# EAGLE schematic prog (EAGLE 7.6.0)
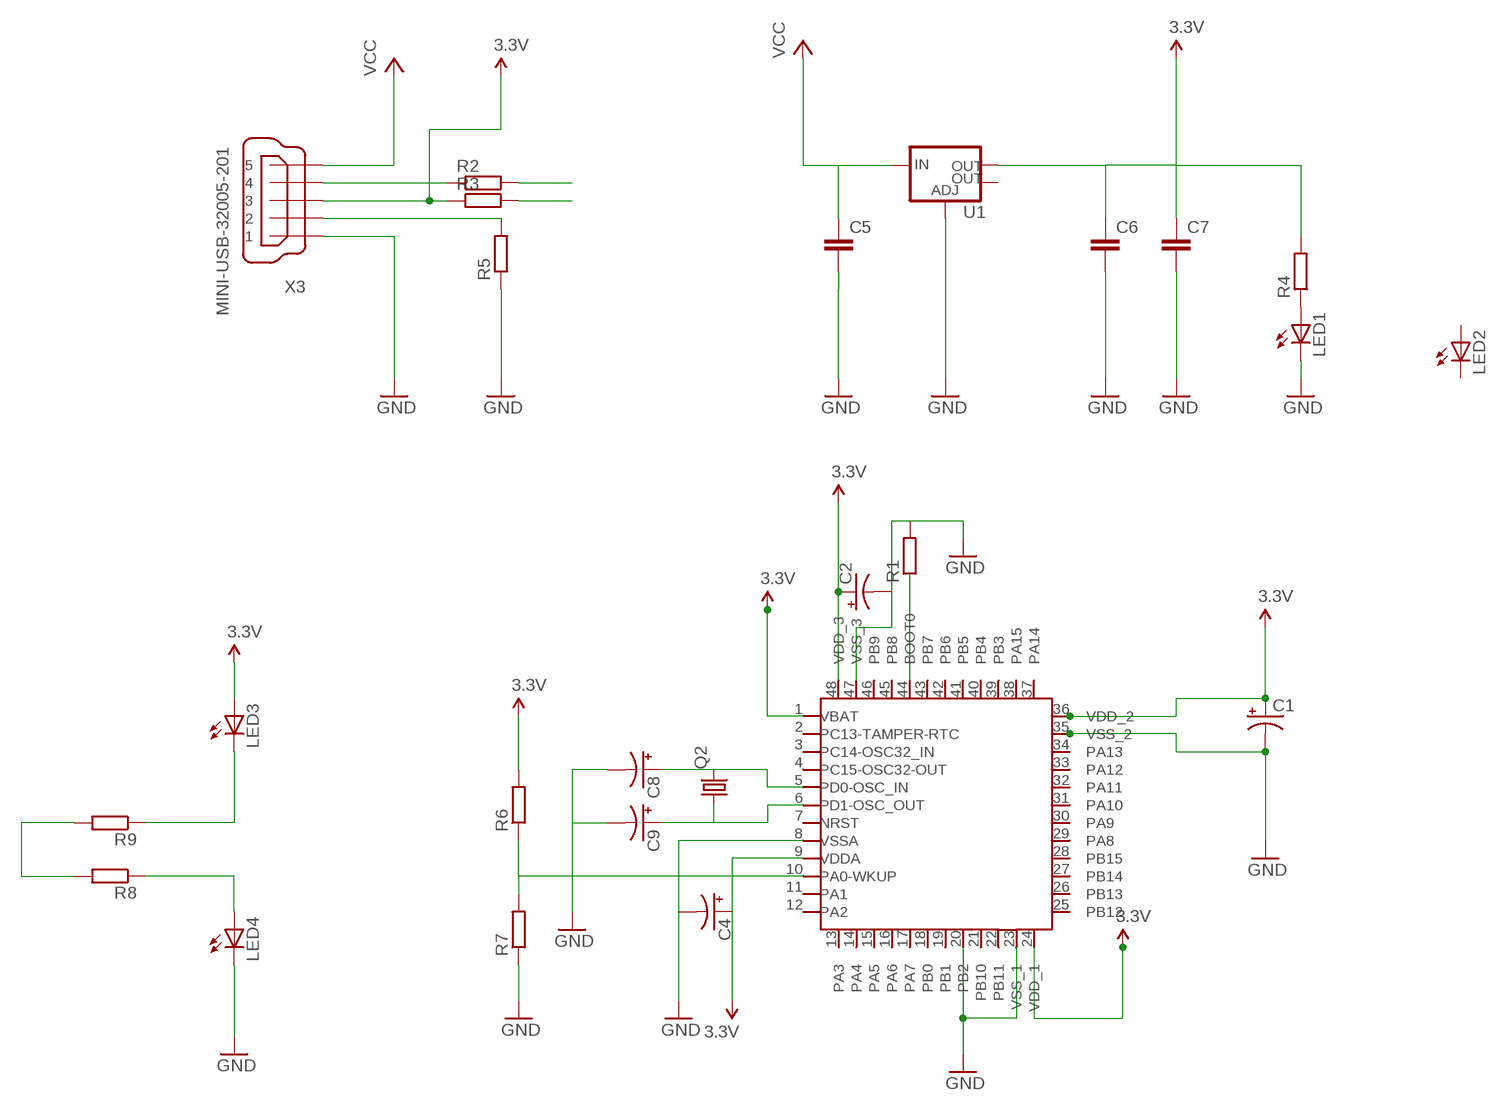
[diagram p0: schematic, sheet 1]

## Parts
C1  POLARIZED_CAPACITORA3216-18  [A3216-18]
C2  POLARIZED_CAPACITORA3216-18  [A3216-18]
C4  POLARIZED_CAPACITORA3216-18  [A3216-18]
C5  C  [C0805]
C6  C  [C0805]
C7  C  [C0805]
C8  POLARIZED_CAPACITORA3216-18  [A3216-18]
C9  POLARIZED_CAPACITORA3216-18  [A3216-18]
LED1  LEDCHIP-LED0805  [CHIP-LED0805]
LED2  LEDCHIP-LED0805  [CHIP-LED0805]
LED3  LEDCHIP-LED0805  [CHIP-LED0805]
LED4  LEDCHIP-LED0805  [CHIP-LED0805]
Q2  CRYSTALSM49  [SM49]
R1  R  [R0805]
R2  R  [R0805]
R3  R  [R0805]
R4  R  [R0805]
R5  R  [R0805]
R6  R  [R0805]
R7  R  [R0805]
R8  R  [R0805]
R9  R  [R0805]
U1  V_REG_LM1117SOT223  [SOT223]
U$1  STM32F103_TQFP48_7X7  [LQFP48_7X7]
X3  MINI-USB-32005-201  [32005-201]

## Nets
3.3V: C1.+ C2.+ C4.+ C6.1 C7.1 LED3.A R3.1 R4.2 R6.2 U1.2(OUT) U$1.1(VBAT) U$1.9(VDDA) U$1.24(VDD_1) U$1.36(VDD_2) U$1.48(VDD_3) X3.3
GND: C1.- C2.- C4.- C5.2 C6.2 C7.2 C8.- C9.- LED1.C LED4.C R1.2 R5.1 R7.1 U1.1(ADJ) U$1.8(VSSA) U$1.20(PB2) U$1.23(VSS_1) U$1.35(VSS_2) U$1.47(VSS_3) X3.1
LED_ST: R8.2 R9.2
N$1: LED1.A R4.1
N$2: R1.1 U$1.44(BOOT0)
N$3: R5.2 X3.2
N$4: R2.1 X3.4
N$5: R6.1 R7.2 U$1.10(PA0-WKUP)
N$6: LED3.C R9.1
N$7: LED4.A R8.1
N$9: C9.+ Q2.1 U$1.6(PD1-OSC_OUT)
N$10: R2.2
N$11: R3.2
N$12: C8.+ Q2.2 U$1.5(PD0-OSC_IN)
VCC: C5.1 U1.3(IN) X3.5
Unconnected: LED2.A LED2.C U1.4(OUT) U$1.2(PC13-TAMPER-RTC) U$1.3(PC14-OSC32_IN) U$1.4(PC15-OSC32-OUT) U$1.7(NRST) U$1.11(PA1) U$1.12(PA2) U$1.13(PA3) U$1.14(PA4) U$1.15(PA5) U$1.16(PA6) U$1.17(PA7) U$1.18(PB0) U$1.19(PB1) U$1.21(PB10) U$1.22(PB11) U$1.25(PB12) U$1.26(PB13) U$1.27(PB14) U$1.28(PB15) U$1.29(PA8) U$1.30(PA9) U$1.31(PA10) U$1.32(PA11) U$1.33(PA12) U$1.34(PA13) U$1.37(PA14) U$1.38(PA15) U$1.39(PB3) U$1.40(PB4) U$1.41(PB5) U$1.42(PB6) U$1.43(PB7) U$1.45(PB8) U$1.46(PB9)

## Library data of the parts
C1 C2 C4 C8 C9 = ng:POLARIZED_CAPACITOR: polarized capacitor
C5-C7 = eagle-ltspice:C: CAPACITOR, European symbol; SPICEMODEL: NONE; SPICEPREFIX: C
LED1-LED4 = adafruit:LED: LED OSRAM: - CHIPLED LG R971, LG N971, LY N971, LG Q971, LY Q971, LO R971, LY R971 LH N974, LH R974 LS Q976, LO Q976, LY Q976 LO Q996 - Hyper CHIPLED LW Q18S LB Q993, LB Q99A, LB R99A - SideLED LS A670, LO A670, LY A670, LG A670, LP A670 LB A673, LV A673, LT A673, LW A673 LH A674 LY A675 LS A676, LA A676, LO A676, LY A676, LW A676 LS A679, LY A679, LG A679 - Hyper Micro SIDELED® LS Y876, LA Y876, LO Y876, LY Y876 LT Y87S - SmartLED LW L88C, LW L88S LB L89C, LB L89S, LG L890 LS L89K, LO L89K, LY L89K LS L896, LA L896, LO L896, LY L896 - TOPLED LS T670, LO T670, LY T670, LG T670, LP T670 LSG T670, LSP T670, LSY T670, LOP T670, LYG T670 LG T671, LOG T671, LSG T671 LB T673, LV T673, LT T673, LW T673 LH T674 LS T676, LA T676, LO T676, LY T676, LB T676, LH T676, LSB T676, LW T676 LB T67C, LV T67C, LT T67C, LS T67K, LO T67K, LY T67K, LW E67C LS E67B, LA E67B, LO E67B, LY E67B, LB E67C, LV E67C, LT E67C LW T67C LS T679, LY T679, LG T679 LS T770, LO T770, LY T770, LG T770, LP T770 LB T773, LV T773, LT T773, LW T773 LH T774 LS E675, LA E675, LY E675, LS T675 LS T776, LA T776, LO T776, LY T776, LB T776 LHGB T686 LT T68C, LB T68C - Hyper Mini TOPLED® LB M676 - Mini TOPLED Santana® LG M470 LS M47K, LO M47K, LY M47K Source: http://www.osram.convergy.de/
Q2 = adafruit:CRYSTAL: CRYSTAL; OC_FARNELL: unknown; OC_NEWARK: unknown
R1-R9 = eagle-ltspice:R: RESISTOR, European symbol; SPICEMODEL: NONE; SPICEPREFIX: R
U1 = SparkFun-PowerIC:V_REG_LM1117: Voltage Regulator LM1117 Standard adjustable voltage regulator but in SMD form. Spark Fun Electronics SKU : COM-00595; PROD_ID: VREG-08170
U$1 = dan:STM32F103_TQFP48_7X7
X3 = con-cypressindustries:MINI-USB-: MINI USB-B Conector Source: www.cypressindustries.com; OC_FARNELL: unknown; OC_NEWARK: unknown